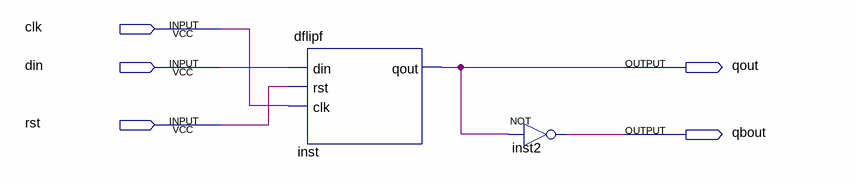
[diagram p0: schematic sheet]
// Quartus schematic hc74.bdf as structural Verilog: 2 symbols, 5 pins
module hc74 (
  input  clk,
  input  din,
  input  rst,
  output qout,
  output qbout
);

  dflipf inst (.din(din), .rst(rst), .clk(clk), .qout(qout));
  not inst2 (qbout, qout);
endmodule
